# Altium schematic sheet Transmitter.SchDoc
size A4; SheetNumber: 1; SheetTotal: 8
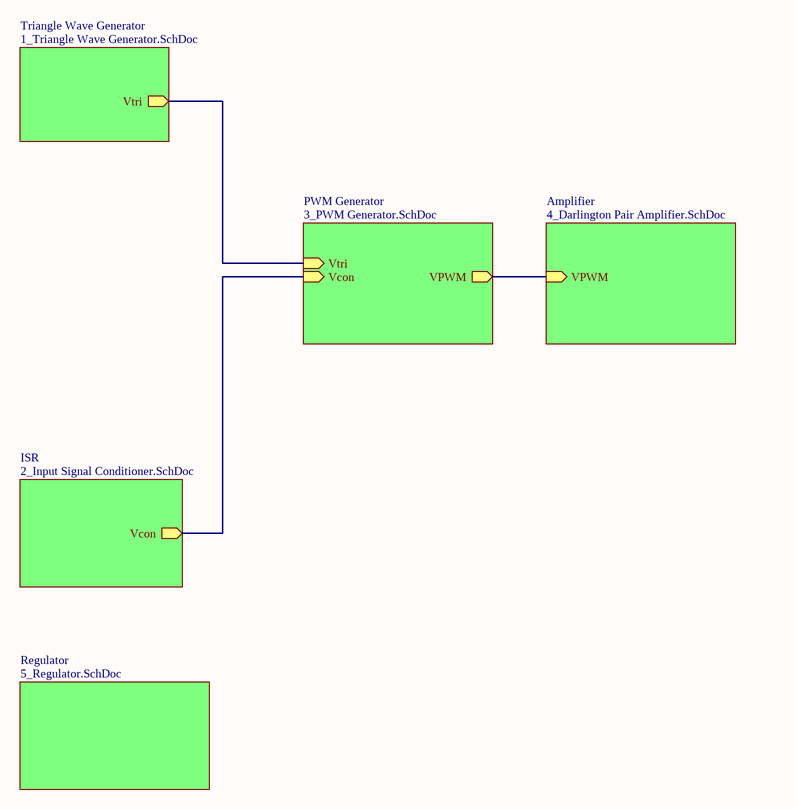
[diagram p0: Transmitter.SchDoc]

## Sub-sheets
Amplifier = 4_Darlington Pair Amplifier.SchDoc: VPWM (in)
ISR = 2_Input Signal Conditioner.SchDoc: Vcon (out)
PWM Generator = 3_PWM Generator.SchDoc: Vcon (in), Vtri (in), VPWM (out)
Regulator = 5_Regulator.SchDoc: no entries
Triangle Wave Generator = 1_Triangle Wave Generator.SchDoc: Vtri (out)

## Nets
(unnamed): sheet Triangle Wave Generator/Vtri, sheet PWM Generator/Vtri
(unnamed): sheet ISR/Vcon, sheet PWM Generator/Vcon
(unnamed): sheet PWM Generator/VPWM, sheet Amplifier/VPWM